# EAGLE design Qwiic_Quad_Relay (EAGLE 9.1.0)
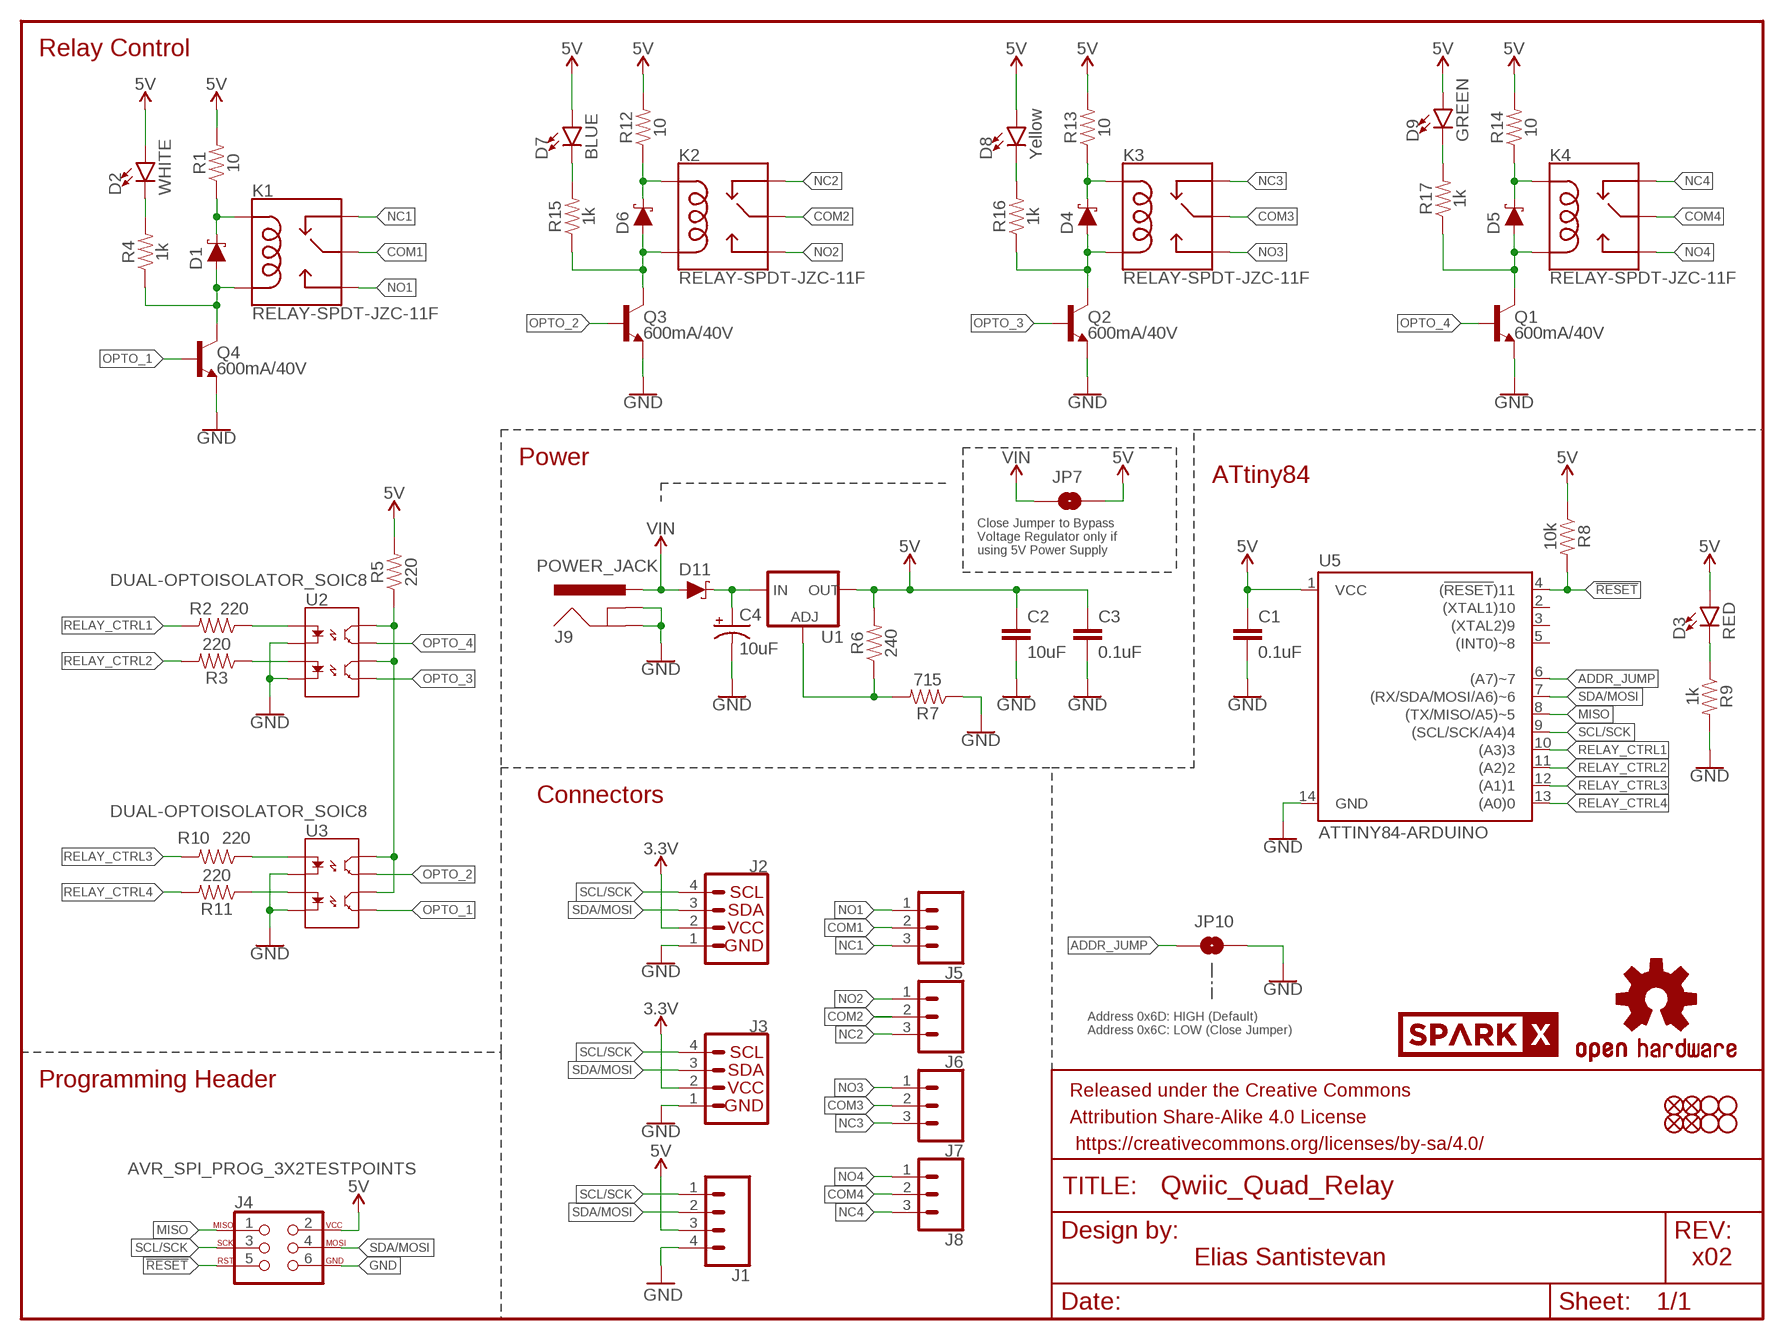
[diagram p0: schematic, sheet 1]

## Parts
C1  0.1uF  0.1UF-0603-25V-(+80/-20%)  [0603]
C2  10uF  10UF-0603-6.3V-20%  [0603]
C3  0.1uF  0.1UF-0603-25V-(+80/-20%)  [0603]
C4  10uF  10UF-POLAR-EIA3528-20V-10%(TANT)  [EIA3528]
D1  1A/23V/620mV  DIODE-SCHOTTKY-BAT20J  [SOD-323]
D2  WHITE  LED-WHITE0603  [LED-0603]
D3  RED  LED-RED0603  [LED-0603]
D4  1A/23V/620mV  DIODE-SCHOTTKY-BAT20J  [SOD-323]
D5  1A/23V/620mV  DIODE-SCHOTTKY-BAT20J  [SOD-323]
D6  1A/23V/620mV  DIODE-SCHOTTKY-BAT20J  [SOD-323]
D7  BLUE  LED-BLUE0603  [LED-0603]
D8  Yellow  LED-YELLOW0603  [LED-0603]
D9  GREEN  LED-GREEN0603  [LED-0603]
D11  1A/40V/500mV  DIODE-SCHOTTKY-SS14  [SMA-DIODE]
FRAME1  FRAME-LETTER  [CREATIVE_COMMONS]
J1  CONN_041X04_NO_SILK  [1X04_NO_SILK]
J2  Qwiic Right Angle  I2C_STANDARDQWIIC  [1X04_1MM_RA]
J3  Qwiic Right Angle  I2C_STANDARDQWIIC  [1X04_1MM_RA]
J4  AVR_SPI_PROG_3X2TESTPOINTS  [2X3_TEST_POINTS]
J5  CONN_03-SCREW-5MM  [SCREWTERMINAL-5MM-3]
J6  CONN_03-SCREW-5MM  [SCREWTERMINAL-5MM-3]
J7  CONN_03-SCREW-5MM  [SCREWTERMINAL-5MM-3]
J8  CONN_03-SCREW-5MM  [SCREWTERMINAL-5MM-3]
J9  POWER_JACK  [POWER_JACK_PTH]
JP1  STAND-OFF  [STAND-OFF]
JP2  FIDUCIAL1X2  [FIDUCIAL-1X2]
JP3  STAND-OFF  [STAND-OFF]
JP4  STAND-OFF  [STAND-OFF]
JP5  STAND-OFF  [STAND-OFF]
JP6  FIDUCIAL1X2  [FIDUCIAL-1X2]
JP7  JUMPER-SMT_2_NO_SILK  [SMT-JUMPER_2_NO_SILK]
JP8  FIDUCIAL1X2  [FIDUCIAL-1X2]
JP9  FIDUCIAL1X2  [FIDUCIAL-1X2]
JP10  JUMPER-SMT_2_NO_SILK  [SMT-JUMPER_2_NO_SILK]
K1  RELAY-SPDT-JZC-11F  [RELAY-JZC]
K2  RELAY-SPDT-JZC-11F  [RELAY-JZC]
K3  RELAY-SPDT-JZC-11F  [RELAY-JZC]
K4  RELAY-SPDT-JZC-11F  [RELAY-JZC]
LOGO1  OSHW-LOGOS  [OSHW-LOGO-S]
Q1  600mA/40V  TRANS_NPN-MMBT2222AL  [SOT23-3]
Q2  600mA/40V  TRANS_NPN-MMBT2222AL  [SOT23-3]
Q3  600mA/40V  TRANS_NPN-MMBT2222AL  [SOT23-3]
Q4  600mA/40V  TRANS_NPN-MMBT2222AL  [SOT23-3]
R1  10  10OHM-0603-1/10W-5%  [0603]
R2  220  220OHM-0603-1/10W-1%  [0603]
R3  220  220OHM-0603-1/10W-1%  [0603]
R4  1k  1KOHM-0603-1/10W-1%  [0603]
R5  220  220OHM-0603-1/10W-1%  [0603]
R6  240  240OHM-0603-1/10W-1%  [0603]
R7  715  715OHM-0603-1/10W-1%  [0603]
R8  10k  10KOHM-0603-1/10W-1%  [0603]
R9  1k  1KOHM-0603-1/10W-1%  [0603]
R10  220  220OHM-0603-1/10W-1%  [0603]
R11  220  220OHM-0603-1/10W-1%  [0603]
R12  10  10OHM-0603-1/10W-5%  [0603]
R13  10  10OHM-0603-1/10W-5%  [0603]
R14  10  10OHM-0603-1/10W-5%  [0603]
R15  1k  1KOHM-0603-1/10W-1%  [0603]
R16  1k  1KOHM-0603-1/10W-1%  [0603]
R17  1k  1KOHM-0603-1/10W-1%  [0603]
U1  V_REG_LM1117SOT223  [SOT223]
U2  DUAL-OPTOISOLATOR_SOIC8  [SO08]
U3  DUAL-OPTOISOLATOR_SOIC8  [SO08]
U5  ATTINY84-ARDUINO  [SO14]
U$12  SPARKX-LOGO4  [SPARKX-MEDIUM]

## Nets
3.3V: J2.2 J3.2
5V: C1.1 C2.1 C3.1 D2.A D3.A D7.A D8.A D9.A J1.3 J4.2 JP7.2 R1.2 R5.2 R6.2 R8.1 R12.2 R13.2 R14.2 U1.2(OUT) U1.4(OUT) U5.1(VCC)
!RESET: J4.5 R8.2 U5.4((!RESET!)11)
ADDR_JUMP: JP10.1 U5.6((A7)~7)
COM1: J5.2 K1.4(MAIN)
COM2: J6.2 K2.4(MAIN)
COM3: J7.2 K3.4(MAIN)
COM4: J8.2 K4.4(MAIN)
GND: C1.2 C2.2 C3.2 C4.C(-) J1.4 J2.1 J3.1 J4.6 J9.GND J9.GNDBREAK JP10.2 Q1.2(E) Q2.2(E) Q3.2(E) Q4.2(E) R7.1 R9.2 U2.2(C1) U2.4(C2) U3.2(C1) U3.4(C2) U5.14(GND)
MISO: J4.1 U5.8((TX/MISO/A5)~5)
N$1: D6.C K2.5(COIL1) R12.1
N$2: D1.A K1.1(COIL2) Q4.3(C) R4.1
N$3: R11.1 U3.3(A2)
N$4: C4.A(+) D11.C U1.3(IN)
N$5: R10.1 U3.1(A1)
N$6: R5.1 U2.6(CL2) U2.8(CL1) U3.6(CL2) U3.8(CL1)
N$7: D1.C K1.5(COIL1) R1.1
N$8: D2.C R4.2
N$9: R2.1 U2.1(A1)
N$11: R3.1 U2.3(A2)
N$12: D6.A K2.1(COIL2) Q3.3(C) R15.1
N$13: D3.C R9.1
N$14: D4.C K3.5(COIL1) R13.1
N$15: D4.A K3.1(COIL2) Q2.3(C) R16.1
N$16: D5.C K4.5(COIL1) R14.1
N$17: D5.A K4.1(COIL2) Q1.3(C) R17.1
N$19: R6.1 R7.2 U1.1(ADJ)
N$20: D9.C R17.2
N$21: D8.C R16.2
N$22: D7.C R15.2
NC1: J5.3 K1.2(NC)
NC2: J6.3 K2.2(NC)
NC3: J7.3 K3.2(NC)
NC4: J8.3 K4.2(NC)
NO1: J5.1 K1.3(NO)
NO2: J6.1 K2.3(NO)
NO3: J7.1 K3.3(NO)
NO4: J8.1 K4.3(NO)
OPTO_1: Q4.1(B) U3.5(EM2)
OPTO_2: Q3.1(B) U3.7(EM1)
OPTO_3: Q2.1(B) U2.5(EM2)
OPTO_4: Q1.1(B) U2.7(EM1)
RELAY_CTRL1: R2.2 U5.10((A3)3)
RELAY_CTRL2: R3.2 U5.11((A2)2)
RELAY_CTRL3: R10.2 U5.12((A1)1)
RELAY_CTRL4: R11.2 U5.13((A0)0)
SCL/SCK: J1.1 J2.4 J3.4 J4.3 U5.9((SCL/SCK/A4)4)
SDA/MOSI: J1.2 J2.3 J3.3 J4.4 U5.7((RX/SDA/MOSI/A6)~6)
VIN: D11.A J9.PWR JP7.1
Unconnected: U5.2((XTAL1)10) U5.3((XTAL2)9) U5.5((INT0)~8)

## Notes on the sheet
- Relay Control
- Power
- ATtiny84
- Close Jumper to Bypass
  Voltage Regulator only if 
  using 5V Power Supply
- Connectors
- Address 0x6D: HIGH (Default)
  Address 0x6C: LOW (Close Jumper)
- Programming Header
- Elias Santistevan | x02

## Library data of the parts
C1 C3 = SparkFun-Capacitors:0.1UF: 0.1µF ceramic capacitors A capacitor is a passive two-terminal electrical component used to store electrical energy temporarily in an electric field.; PROD_ID: CAP-00810
C2 = SparkFun-Capacitors:10UF: 10.0µF ceramic capacitors A capacitor is a passive two-terminal electrical component used to store electrical energy temporarily in an electric field.; PROD_ID: CAP-11015
C4 = SparkFun-Capacitors:10UF-POLAR: 10.0µF polarized capacitors A capacitor is a passive two-terminal electrical component used to store electrical energy temporarily in an electric field.; PROD_ID: CAP-08063
D1 D4-D6 = SparkFun-DiscreteSemi:DIODE-SCHOTTKY: Schottky diode A Schottky diode is a semiconductor diode which has a low forward voltage drop and a very fast switching action.; PROD_ID: DIO-11623
D2 = SparkFun-LED:LED-WHITE: White SMD LED Used in manufacturing several products at SparkFun. Packages: 0603 - Bright White SMD 0603 package[Product Link] <http://www.kingbrightusa.com/product.asp?catalog_name=LED&product_id=APT1608QWF/D> 1206 - Bright White SMD1206 package [Product Link] <http://www.kingbrightusa.com/product.asp?catalog_name=LED&product_id=APT3216QWF/D> 3014 - Super Bright SMD 3014 package [Datasheet] <http://www.lumileds.com/uploads/459/DS208-pdf> SparkFun Products: Blackberry Trackballer Breakout <https://www.sparkfun.com/products/13169> Digital SandBox <https://www.sparkfun.com/products/12651>; PROD_ID: DIO-09004
D3 = SparkFun-LED:LED-RED: Red SMD LED Used in manufacturing of most products at SparkFun Packages: 0603 - SMD 0603 package [Product Link] <http://docs.avagotech.com/docs/AV02-0551EN> 0603 SMART - SMD 0603 SMART package ( more efficient and expensive)[Product Link] <http://www.osram-os.com/Graphics/XPic2/00077099_0.pdf> 1206 - SMD1206 package [Product Link] <https://www.sparkfun.com/datasheets/DevTools/LilyPad/Q150OVS4.pdff> SparkFun Products: Pro Mini 328 -5V <https://www.sparkfun.com/products/821> RedBoard <https://www.sparkfun.com/products/12757> IOIO-OTG <https://www.sparkfun.com/products/13613>; PROD_ID: DIO-00819
D7 = SparkFun-LED:LED-BLUE: Blue SMD LED Used in manufacturing of various products at SparkFun Packages: 0603 - SMD 0603 package [Product Link] <http://www.digikey.com/product-detail/en/SMLE12BC7TT86/511-1589-2-ND/1641808> 1206 - SMD1206 package [Product Link] <http://www.digikey.com/product-detail/en/lite-on-inc/LTST-C150TBKT/160-1643-1-ND/573584> SparkFun Products: ESP8266 Thing-Dev Board <https://www.sparkfun.com/products/13711> RedBoard <https://www.sparkfun.com/products/12757>; PROD_ID: DIO-08575
D8 = SparkFun-LED:LED-YELLOW: Yellow SMD LED Used in manufacturing several products at SparkFun. Packages: 0603 - SMD 0603 package[Product Link] <http://www.kingbrightusa.com/product.asp?catalog_name=LED&product_id=APT1608SYCK> 0603 -SMART - SMART SMD 0603 package (more efficient/more expensive) [Product Link] <http://www.osram-os.com/osram_os/en/products/product-catalog/led-light-emitting-diodes/smartled-0603/ly-l29k/index.jsp> LilyPad - SMD1206 package[Product Datasheet] <https://www.sparkfun.com/datasheets/DevTools/LilyPad/Q150YUS4.pdf> SparkFun Products: Blynk Board <https://www.sparkfun.com/products/13794> IOIO-OTG <https://www.sparkfun.com/products/13613> XBee Explorer Serial <https://www.sparkfun.com/products/13225>; PROD_ID: DIO-09003
D9 = SparkFun-LED:LED-GREEN: Green SMD LED Used in manufacturing of various products at SparkFun Packages: 0603 - SMD 0603 package [Product Link] <http://www.futureelectronics.com/en/technologies/semiconductors/optoelectronics/leds/Pages/9894312-LTST-C190GKT.aspx?CrossPart=HSMG-C190&IM=0> LilyPad 1206 - SMD1206 LilyPad package [Product Link] <http://www.futureelectronics.com/en/Technologies/Product.aspx?ProductID=IN150NGHARVATEKCORPORATION2049943&IM=0> 1206 - SMD1206 package [Product Link] <http://www.futureelectronics.com/en/technologies/semiconductors/optoelectronics/leds/Pages/8315665-LTST-C150KGKT.aspx?IM=0> 1206 Bottom Mount -SMD 1206 Bottom Mount [Product Link] <http://www.digikey.com/product-detail/en/lite-on-inc/LTST-C230KGKT/160-1456-1-ND/386854> SparkFun Products: Pro Mini 328 -5V <https://www.sparkfun.com/products/821> RedBoard <https://www.sparkfun.com/products/12757> MP3 Trigger <https://www.sparkfun.com/products/13720> Makey Makey <https://www.sparkfun.com/products/11076>; PROD_ID: DIO-00821
D11 = SparkFun-DiscreteSemi:DIODE-SCHOTTKY: Schottky diode A Schottky diode is a semiconductor diode which has a low forward voltage drop and a very fast switching action.; PROD_ID: DIO-08053
FRAME1 = SparkFun-Aesthetics:FRAME-LETTER: Schematic Frame - Letter Standard 8.5x11 US Letter frame
J1 = SparkFun-Connectors:CONN_04: Multi connection point. Often used as Generic Header-pin footprint for 0.1 inch spaced/style header connections On any of the 0.1 inch spaced packages, you can populate with these: Break Away Headers - Straight <https://www.sparkfun.com/products/116> (PRT-00116) Break Away Male Headers - Right Angle <https://www.sparkfun.com/products/553> (PRT-00553) Female Headers <https://www.sparkfun.com/products/115> (PRT-00115) Break Away Headers - Machine Pin <https://www.sparkfun.com/products/117> (PRT-00117) Break Away Female Headers - Swiss Machine Pin <https://www.sparkfun.com/products/743> (PRT-00743) For SCREWTERMINALS and SPRING TERMINALS visit here: Screw Terimnals on SparkFun.com <https://www.sparkfun.com/search/results?term=Screw+Terminals> (5mm/3.5mm/2.54mm spacing) This device is also useful as a general connection point to wire up your design to another part of your project. Our various solder wires solder well into these plated through hole pads. Hook-Up Wire - Assortment (Stranded, 22 AWG) <https://www.sparkfun.com/products/11375> (PRT-11375) Hook-Up Wire - Assortment (Solid Core, 22 AWG) <https://www.sparkfun.com/products/11367> (PRT-11367) View the entire wire category on our website here <https://www.sparkfun.com/categories/141> Special notes: Molex polarized connector foot print use with SKU : PRT-08231 with associated crimp pins and housings. 1MM SMD Version SKU: PRT-10208; PROD_ID: CONN-09696
J2 J3 = SparkFun-Connectors:I2C_STANDARD: SparkFun I2C Standard Pinout Header SparkFun has standardized on a pinout for all I2C based sensor breakouts. This pinout allows I2C boards to be plugged directly into the headers on Arduino Uno compatible boards, and to be daisy chained easily. Example SparkFun Products: SparkFun Atmospheric Sensor Breakout - BME280 <https://www.sparkfun.com/products/13676> SparkFun Altitude/Pressure Sensor Breakout - MPL3115A2 <https://www.sparkfun.com/products/11084> SparkFun TOF Range Finder Sensor - VL6180 <https://www.sparkfun.com/products/12785>; PROD_ID: CONN-13694
J4 = SparkFun-Connectors:AVR_SPI_PROG_3X2: AVR ISP 6 Pin This is the reduced ISP connector for AVR programming. Common on Arduino. This footprint will take up less PCB space and can be used with a 10-pin to 6-pin adapter such as SKU: BOB-08508 **Special note about "TEST_POINT" package. The stop mask is on the top side, so if you want your programming test points to be on the bottom of your board, make sure to place this package on the bottom side of the board. This also ensure that the orientation to program from the bottom side will be correct. SparkFun Products: SparkFun ISP Pogo Adapter <https://www.sparkfun.com/products/11591> - NS Tiny AVR Programmer <https://www.sparkfun.com/products/11801> -PTH
J5-J8 = SparkFun-Connectors:CONN_03: Multi connection point. Often used as Generic Header-pin footprint for 0.1 inch spaced/style header connections On any of the 0.1 inch spaced packages, you can populate with these: Break Away Headers - Straight <https://www.sparkfun.com/products/116> (PRT-00116) Break Away Male Headers - Right Angle <https://www.sparkfun.com/products/553> (PRT-00553) Female Headers <https://www.sparkfun.com/products/115> (PRT-00115) Break Away Headers - Machine Pin <https://www.sparkfun.com/products/117> (PRT-00117) Break Away Female Headers - Swiss Machine Pin <https://www.sparkfun.com/products/743> (PRT-00743) Stackable Header - 3 Pin (Female, 0.1") <https://www.sparkfun.com/products/13875> (PRT-13875) For SCREWTERMINALS and SPRING TERMINALS visit here: Screw Terimnals on SparkFun.com <https://www.sparkfun.com/search/results?term=Screw+Terminals> (5mm/3.5mm/2.54mm spacing) This device is also useful as a general connection point to wire up your design to another part of your project. Our various solder wires solder well into these plated through hole pads. Hook-Up Wire - Assortment (Stranded, 22 AWG) <https://www.sparkfun.com/products/11375> (PRT-11375) Hook-Up Wire - Assortment (Solid Core, 22 AWG) <https://www.sparkfun.com/products/11367> (PRT-11367) View the entire wire category on our website here <https://www.sparkfun.com/categories/141> Special notes: Molex polarized connector foot print use with SKU : PRT-08232 with associated crimp pins and housings.; PROD_ID: CONN-10134; SF_SKU: PRT-08433
J9 = SparkFun-Connectors:POWER_JACK: Power Jack Connector This is the standard 5.5mm barrel jack for power. The PTH is the most common, proven, reliable, footprint. The Slot footprint only works if the mill layer is transmitted to the PCB fab house so be warned. Here are the connectors we sell at SparkFun: DC Barrel Power Jack/Connector <https://www.sparkfun.com/products/119> (PRT-00119) DC Barrel Power Jack/Connector (SMD) <https://www.sparkfun.com/products/12748> (PRT-12748) DC Barrel Jack Adapter - Breadboard Compatible <https://www.sparkfun.com/products/10811> (PRT-10811) It is used on this SparkFun product (and many, many others): SparkFun RedBoard - Programmed with Arduino <https://www.sparkfun.com/products/12757> (DEV-12757) Also, if you need a mating power supply or connector, please check these out: Wall Adapter Power Supply - 9VDC 650mA <https://www.sparkfun.com/products/298> (TOL-00298) DC Barrel Jack Adapter - Male <https://www.sparkfun.com/products/10287> (PRT-10287); PROD_ID: CONN-08197
JP1 JP3-JP5 = SparkFun:STAND-OFF: Stand Off This is the mechanical footprint for a #4 phillips button head screw. Use the keepout ring to avoid running the screw head into surrounding components. SKU : PRT-00447
JP2 JP6 JP8 JP9 = SparkFun-Aesthetics:FIDUCIAL: Fiducial Alignment Points Point-of-reference for pick-and-place machines and other optical instruments.
JP7 JP10 = SparkFun-Jumpers:JUMPER-SMT_2_NO: Normally open jumper This jumper has two pads in close proximity to each other. Apply solder to close the connection. Round pads are easier to solder for beginners, but are a lot larger. SparkFun Product that uses the round pads: SparkFun EL Sequencer <https://www.sparkfun.com/products/12781>
K1-K4 = SparkFun-Electromechanical:RELAY-SPDT: SPDT Electromechanical Relay Single-pole, double-throw sealed relays. When current is applied to the coil, it throws a simple changeover switch, terminating the connection from the NC contact to ground and closing the NO contact. Use them to switch high voltage/high current devices. SparkFun Products JQX-15F: Relay SPDT Sealed - 20A <https://www.sparkfun.com/products/10924> (COM-10924) JZC-11F: Relay SPDT Sealed <https://www.sparkfun.com/products/100> (COM-00100); PROD_ID: COMP-09533; SF_SKU: COM-00100
LOGO1 = SparkFun-Aesthetics:OSHW-LOGO: Open-Source Hardware (OSHW) Logo This logo indicates the piece of hardware it is found on incorporates a OSHW license and/or adheres to the definition of open source hardware found here: http://freedomdefined.org/OSHW
Q1-Q4 = SparkFun-DiscreteSemi:TRANS_NPN: NPN transistor Current controlled devices typically used to amplify current or used as a switch. BC547 - COM-08928 <http://www.sparkfun.com/products/8928> (TO-92 45V 100mA) (1.Collector 2.Base 3.Emitter) 2N3904 - COM-00521 <http://www.sparkfun.com/products/521> (TO-92 40V 200mA) (1.Emitter 2.Base 3.Collector) P2N2222A - COM-12852 <http://www.sparkfun.com/products/12852> (TO-92 40V 600mA) (1.Collector 2.Base 3.Emitter); PROD_ID: TRANS-08049
R1 R12-R14 = SparkFun-Resistors:10OHM: 10Ω resistor A resistor is a passive two-terminal electrical component that implements electrical resistance as a circuit element. Resistors act to reduce current flow, and, at the same time, act to lower voltage levels within circuits. - Wikipedia; PROD_ID: RES-09834
R2 R3 R5 R10 R11 = SparkFun-Resistors:220OHM: 220Ω resistor A resistor is a passive two-terminal electrical component that implements electrical resistance as a circuit element. Resistors act to reduce current flow, and, at the same time, act to lower voltage levels within circuits. - Wikipedia; PROD_ID: RES-07861
R4 R9 R15-R17 = SparkFun-Resistors:1KOHM: 1kΩ resistor A resistor is a passive two-terminal electrical component that implements electrical resistance as a circuit element. Resistors act to reduce current flow, and, at the same time, act to lower voltage levels within circuits. - Wikipedia; PROD_ID: RES-07856
R6 = SparkFun-Resistors:240OHM: 240Ω resistor A resistor is a passive two-terminal electrical component that implements electrical resistance as a circuit element. Resistors act to reduce current flow, and, at the same time, act to lower voltage levels within circuits. - Wikipedia; PROD_ID: RES-07849
R7 = SparkFun-Resistors:715OHM: 715Ω resistor A resistor is a passive two-terminal electrical component that implements electrical resistance as a circuit element. Resistors act to reduce current flow, and, at the same time, act to lower voltage levels within circuits. - Wikipedia; PROD_ID: RES-07850
R8 = SparkFun-Resistors:10KOHM: 10kΩ resistor A resistor is a passive two-terminal electrical component that implements electrical resistance as a circuit element. Resistors act to reduce current flow, and, at the same time, act to lower voltage levels within circuits. - Wikipedia; PROD_ID: RES-00824
U1 = SparkFun-IC-Power:V_REG_LM1117: Voltage Regulator LM1117 Standard adjustable voltage regulator but in SMD form. Spark Fun Electronics SKU : COM-00595; PROD_ID: VREG-08170
U2 U3 = SparkFun-DiscreteSemi:DUAL-OPTOISOLATOR: Optocoupler, Phototransistor Output, Dual Channel Optically coupled pairs with a gallium arsenide infrared LED and a silicon NPN phototransistor. Signal information, including a DC level, can be transmitted by the device while maintaining a high degree of electrical isolation between input and output. Datasheet <https://www.sparkfun.com/datasheets/Components/SMD/ild205t.pdf> SparkFun Products: SparkFun Opto-isolator Breakout <https://www.sparkfun.com/products/9118>; PROD_ID: IC-09076
U5 = SparkFun-IC-Microcontroller:ATTINY84-ARDUINO; PROD_ID: IC-11285
U$12 = SparkX:SPARKX-LOGO

## Board
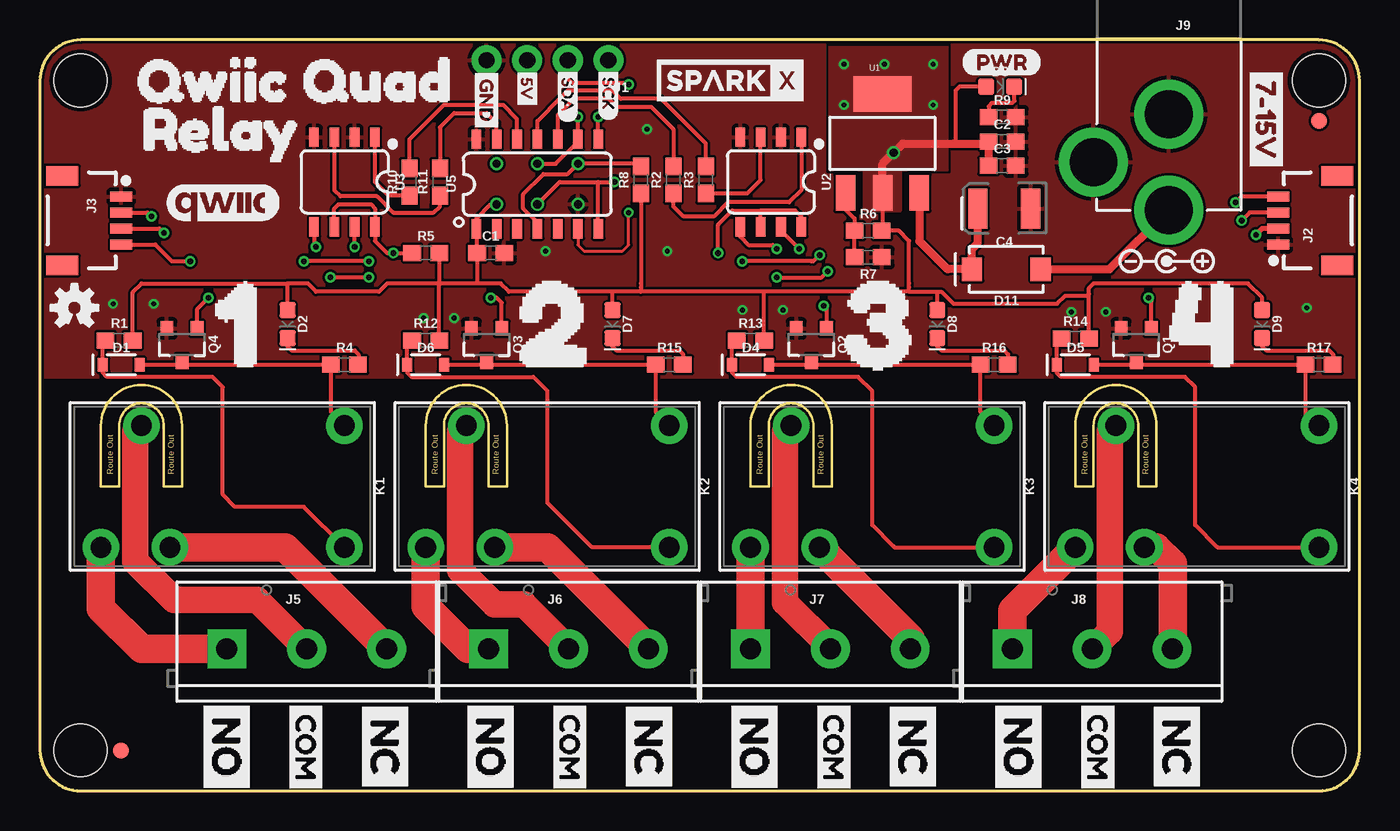
[diagram p1: board, top side]
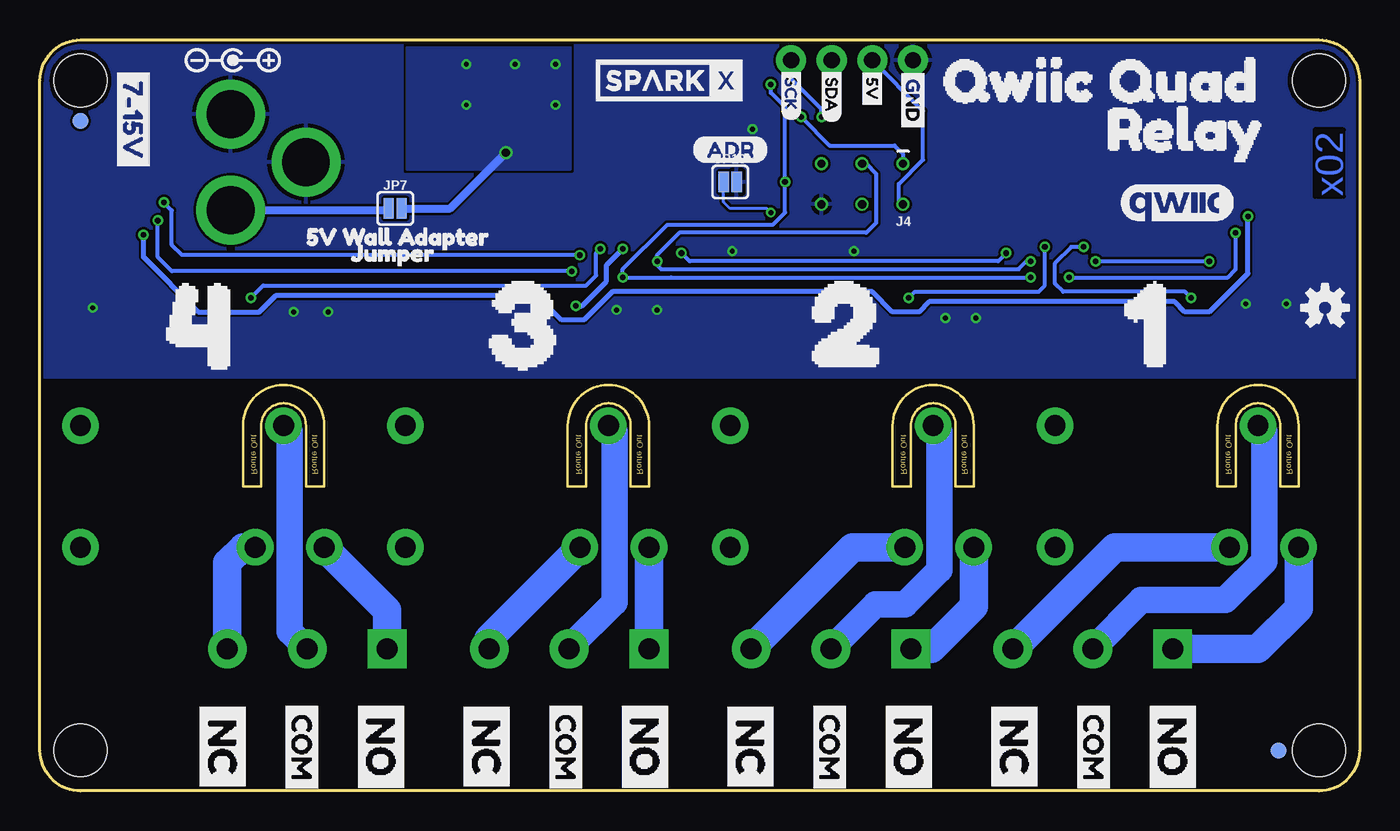
[diagram p2: board, bottom side, seen from below]

Size 82.55 x 46.99 mm. Coordinates in mm from the lower left corner, seen from the top.
Outline: 80.01,46.99 2.54,46.99 arc90 0,44.45 0,2.54 arc90 2.54,0 80.01,0 arc90 82.55,2.54 82.55,44.45 arc90 80.01,46.99
Copper layers (1*16): Top 0.035mm / dielectric 1.5mm / Bottom 0.035mm
Design rules "SparkFun-2-layer-PCBWay-LIMIT": minimum track width 6mil, minimum drill 0.3mm, track to track 6mil, track to pad 6mil, pad to pad 6mil, via to via 6mil, smd to smd 6mil, copper to edge 6mil, drill to drill 6mil, minimum pad ring 6mil, minimum via ring 6mil, stop-mask expansion 4mil, vias tented up to drill 25mil, thermal gap 10mil
Milling: 40 lines

### Footprints (pad centres in the part's own frame; a part is rotated, then mirrored left to right if it is on the bottom)
0603 = smd 1.1 x 1: 1 -0.85,0; 2 0.85,0
EIA3528 = smd 1.2 x 2.5: A 1.65,0; C -1.65,0
SOD-323 = smd 0.63 x 0.83: A 1.15,0; C -1.15,0
LED-0603 = smd 1 x 1: A -0.877,0; C 0.877,0
SMA-DIODE = smd 1.27 x 1.47: A -2.15,0; C 2.15,0
1X04_NO_SILK = drill 1.016 pad 1.88: 1 0,0; 2 2.54,0; 3 5.08,0; 4 7.62,0
1X04_1MM_RA = smd 0.6 x 1.35: 1 -1.5,0; 2 -0.5,0; 3 0.5,0; 4 1.5,0 | smd 1.2 x 2: NC1 2.8,-3.675; NC2 -2.8,-3.675
2X3_TEST_POINTS = drill 0.508: 1 -2.54,-1.27; 2 -2.54,1.27; 3 0,-1.27; 4 0,1.27; 5 2.54,-1.27; 6 2.54,1.27
SCREWTERMINAL-5MM-3 = drill 1.3 pad 2.413 square: 1 0,0 | drill 1.3 pad 2.413: 2 5,0; 3 10,0
POWER_JACK_PTH = drill 2.997 pad 4.318: GND 0,7.7; GNDBREAK 4.7,10.7; PWR 0,13.7
STAND-OFF = hole 3.302: 0,0
FIDUCIAL-1X2 = smd 1 x 1: 1 0,0
SMT-JUMPER_2_NO_SILK = smd 0.635 x 1.27: 1 -0.406,0; 2 0.406,0
RELAY-JZC = drill 1.3 pad 2.286: 1 3.81,-8.89; 2 -3.81,2.032; 3 -3.81,6.35; 4 3.81,3.81; 5 -3.81,-8.89
SOT23-3 = smd 0.8 x 0.9: 1 -0.95,-1; 2 0.95,-1; 3 0,1.1
SOT223 = smd 1.219 x 2.235: 1 -2.311,-3.099; 2 0,-3.099; 3 2.311,-3.099 | smd 3.6 x 2.2: 4 0,3.099
SO08 = smd 0.6 x 1.2: 1 -1.905,-2.8; 2 -0.635,-2.8; 3 0.635,-2.8; 4 1.905,-2.8; 5 1.905,2.8; 6 0.635,2.8; 7 -0.635,2.8; 8 -1.905,2.8
SO14 = smd 0.6 x 1.2: 1 -3.175,-2.8; 2 -1.905,-2.8; 3 -0.635,-2.8; 4 0.635,-2.8; 5 1.905,-2.8; 6 3.175,-2.8; 7 4.445,-2.8; 8 4.445,2.8; 9 3.175,2.8; 10 1.905,2.8; 11 0.635,2.8; 12 -0.635,2.8; 13 -1.905,2.8; 14 -3.175,2.8

### Placement (x,y rotation side)
C1  28.19,33.66 0 top
C2  60.2,40.64 0 top
C3  60.2,39.12 0 top
C4  60.33,36.45 180 top
D1  5.08,26.67 0 top
D2  15.49,29.21 270 top
D3  60.07,44.07 0 top
D4  44.45,26.67 0 top
D5  64.77,26.67 0 top
D6  24.13,26.67 0 top
D7  35.81,29.21 270 top
D8  56.13,29.21 270 top
D9  76.45,29.21 270 top
D11  60.45,32.64 180 top
FRAME1  10.16,-16.51 0 top  (outside the outline)
J1  35.56,45.72 180 top
J2  77.47,35.69 90 top
J3  5.08,35.69 270 top
J4  31.11,37.97 180 bottom
J5  11.68,8.89 0 top
J6  28.07,8.89 0 top
J7  44.45,8.89 0 top
J8  60.83,8.89 0 top
J9  70.61,50.04 180 top
JP1  2.54,2.54 0 top
JP2  80.01,41.91 0 bottom
JP3  2.54,44.45 0 top
JP4  80.01,44.45 0 top
JP5  80.01,2.54 0 top
JP6  5.08,2.54 0 bottom
JP7  60.33,36.45 0 bottom
JP8  5.08,2.54 0 top
JP9  80.01,41.91 0 top
JP10  39.37,38.1 0 bottom
K1  10.16,19.05 90 top
K2  30.48,19.05 90 top
K3  50.8,19.05 90 top
K4  71.12,19.05 90 top
LOGO1  2.16,30.23 0 top
Q1  68.58,27.94 180 top
Q2  48.26,27.94 180 top
Q3  27.94,27.94 180 top
Q4  8.89,27.94 180 top
R1  4.95,28.19 0 top
R2  39.62,38.23 90 top
R3  41.66,38.23 90 top
R4  19.05,26.67 0 top
R5  24.13,33.66 0 top
R6  51.82,35.05 0 top
R7  51.82,33.4 180 top
R8  37.59,38.23 90 top
R9  60.2,42.16 0 top
R10  23.11,38.1 90 top
R11  25.02,38.1 90 top
R12  24.13,28.19 0 top
R13  44.45,28.19 0 top
R14  64.77,28.32 0 top
R15  39.37,26.67 0 top
R16  59.69,26.67 0 top
R17  80.01,26.67 0 top
U1  52.7,40.51 0 top
U2  45.72,38.1 180 top
U3  19.05,38.1 180 top
U5  30.48,37.97 0 top
U$1  [PWR-()-04]  57.66,45.59 0 top
U$2  [20]  25.4,29.21 0 top
U$3  [10]  6.35,29.21 0 top
U$4  [30]  45.72,29.21 0 top
U$5  [40]  66.04,29.21 0 top
U$6  [QWIIC_QUAD_0]  3.81,44.45 0 top
U$7  [RELAY0]  4.19,41.4 0 top
U$8  [SCK-[)-03]  35.56,45.34 270 top
U$9  [GND-03]  27.94,45.34 270 top
U$10  [5V0]  30.48,45.34 270 top
U$11  [SDA0]  33.02,45.34 270 top
U$12  43.18,44.45 0 top
U$13  [OSHW-LOGO-S]  2.16,30.23 0 bottom
U$14  [SPARKX-MEDIUM]  43.18,44.45 0 bottom
U$15  [NO0]  11.68,6.22 270 top
U$16  [COM0]  16.64,5.97 270 top
U$17  [NC0]  21.59,6.1 270 top
U$18  [NO0]  28.19,6.22 270 top
U$19  [COM0]  33.15,5.97 270 top
U$20  [NC0]  38.1,6.1 270 top
U$21  [NO0]  44.7,6.22 270 top
U$22  [COM0]  49.66,5.97 270 top
U$23  [NC0]  54.61,6.1 270 top
U$24  [NO0]  61.21,6.22 270 top
U$25  [COM0]  66.17,5.97 270 top
U$26  [NC0]  71.12,6.1 270 top
U$27  [NO0]  44.7,6.22 270 bottom
U$28  [COM0]  66.17,5.97 270 bottom
U$29  [NC0]  71.12,6.1 270 bottom
U$30  [NO0]  61.21,6.22 270 bottom
U$31  [COM0]  49.66,5.97 270 bottom
U$32  [NC0]  54.61,6.1 270 bottom
U$33  [NO0]  28.19,6.22 270 bottom
U$34  [COM0]  33.15,5.97 270 bottom
U$35  [NC0]  38.1,6.1 270 bottom
U$36  [NO0]  11.68,6.22 270 bottom
U$37  [COM0]  16.64,5.97 270 bottom
U$38  [NC0]  21.59,6.1 270 bottom
U$39  [10]  19.3,29.21 0 bottom
U$40  [20]  38.86,29.21 0 bottom
U$41  [30]  59.05,29.21 0 bottom
U$42  [40]  79.25,29.08 0 bottom
U$43  [QWIIC_QUAD_0]  28.32,44.45 0 bottom
U$44  [RELAY0]  18.03,41.4 0 bottom
U$45  [GND-03]  27.94,45.34 270 bottom
U$46  [5V0]  30.48,45.34 270 bottom
U$47  [SDA0]  33.02,45.34 270 bottom
U$48  [SCK-[)-03]  35.56,45.34 270 bottom
U$49  [7#15V0]  76.71,45.59 270 top
U$50  [5V_WALL_ADAPTER0]  66.8,34.67 0 bottom
U$51  [POLARITY_MARKING_CENTER_POSITIVE#JPG]  70.48,33.15 0 top
U$52  [JUMPER0]  64.01,33.66 0 bottom
U$53  [7#15V0]  76.71,45.59 270 bottom
U$54  [POLARITY_MARKING_CENTER_POSITIVE#JPG]  70.48,45.72 0 bottom
U$55  [QWIIC#JPG]  11.43,36.83 0 top
U$56  [ADR-()-04]  41.78,40.13 0 bottom
U$57  [QWIIC#JPG]  11.43,36.83 0 bottom

### Tracks (layer width: path | path; a pad name or v marks a point on that pad's centre or on a via)
3.3V  (via drill 0.35)
  Top 0.254: J3.2 6.74,36.19 v6.99,35.94
  Top 0.305: J2.2 76.46,35.19 v76.07,34.8
  Bottom 0.305: v6.99,35.94 6.99,32.38 9.4,29.97 10.92,29.97 11.56,30.61 26.92,30.61 27.56,29.97 29.21,29.97 30.48,31.24 46.74,31.24 48.51,29.46 49.91,29.46 51.44,30.99 67.82,30.99 68.83,29.97 72.64,29.97 76.07,33.4 v76.07,34.8
5V  (via drill 0.3, 0.51)
  Top 0.254: 54.37,31.24 45.3,31.24 | 45.3,31.24 37.59,31.24 | R8.1 37.59,31.75 37.59,31.5 37.59,31.24 | 15.49,31.75 6.35,31.75 5.8,31.2 R1.2 | D9.A 76.45,30.86 75.56,31.75 65.91,31.75 65.66,31.5 65.62,31.46 65.62,31.11 | D2.A 15.49,31.75 | J4.2 28.19,36.7 27.3,35.81 U5.1 27.34,35.13 C1.1 27.34,31.79 27.3,31.75 | D3.A 57.53,44.07 57.28,43.81 57.28,40.64 57.15,40.51 | U1.2 52.7,35.09 | 52.7,35.09 R6.2 | 52.7,35.09 52.74,35.05 53.72,35.05 54.37,34.41 54.37,31.75 54.37,31.5 54.37,31.24 | R14.2 65.62,31.11 | R13.2 45.3,31.24 | 37.59,31.24 35.81,31.24 | 35.81,31.24 29.34,31.24 28.83,31.75 27.3,31.75 | 27.3,31.75 25.02,31.75 | 25.02,31.75 24.89,31.75 | 24.89,31.75 21.72,31.75 21.21,31.24 17.27,31.24 16.76,31.75 15.49,31.75 | R12.2 24.98,31.66 24.89,31.75 | 25.02,31.75 24.98,31.79 R5.2 | D7.A 35.81,31.24 | 54.37,31.24 56.13,31.24 | 56.13,31.24 56.39,31.24 57.15,30.48 63.63,30.48 64.14,30.99 65.49,30.99 65.62,31.11 | D8.A 56.13,31.24
  Top 0.508: C3.1 C2.1 59.22,40.51 57.15,40.51 53.98,40.51 v53.4,39.94 52.7,39.24 U1.2
  Bottom 0.254: J1.3 27.3,42.55 27.3,39.5 28.83,37.97 28.83,36.96 J4.2
  Bottom 0.508: JP7.2 56.9,36.45 v53.4,39.94
  other vias: 50.29,45.47 52.83,45.47 55.88,45.47 55.88,42.93 50.29,42.93
  pour Top (isolate 0.305, no thermals): 49.4,46.61 49.4,38.86 51.56,38.86 51.56,36.32 53.85,36.32 53.85,38.86 56.77,38.86 56.77,46.61
  pour Bottom (isolate 0.305, no thermals): 49.4,46.61 49.4,38.86 59.56,38.86 59.56,46.61
!RESET
  Top 0.254: U5.4 31.11,35.55 30.23,36.44 30.23,37.34 31.5,38.61 33.02,38.61 J4.5 37.43,39.24 R8.2
ADDR_JUMP  (via drill 0.3)
  Top 0.203: U5.6 33.66,34.16 34.04,33.78 36.45,33.78 36.83,34.16 v36.83,36.2
  Bottom 0.203: v36.83,36.2 37.08,36.45 39.37,36.45 39.78,36.85 JP10.1
COM1
  Top 1.651: J5.2 16.64,8.89 13.59,11.94 8.89,11.94 8.38,11.94 5.97,14.35 5.97,22.48 K1.4
  Bottom 1.651: J5.2 13.64,11.94 8.38,11.94 5.97,14.35 5.97,22.48 K1.4
COM2
  Top 1.651: J6.2 30.27,11.68 28.45,11.68 26.29,13.84 26.29,22.48 K2.4
  Bottom 1.651: J6.2 30.27,11.68 28.45,11.68 26.29,13.84 26.29,22.48 K2.4
  Bottom 1.778: J6.2
COM3
  Top 1.651: 49.45,8.97 46.61,11.81 46.61,22.48 K3.4
  Top 1.778: 49.45,8.97 J7.2
  Bottom 1.651: 49.45,8.97 46.61,11.81 46.61,22.48 K3.4
  Bottom 1.778: 49.45,8.97 J7.2
COM4
  Top 1.651: K4.4 66.93,22.48 66.93,9.99 J8.2
  Bottom 1.651: K4.4 66.93,22.48 66.93,9.99 J8.2
GND  (via drill 0.3)
  other vias: 46.48,30.1 66.67,29.97 25.91,29.59 7.11,30.48 64.52,29.97 79.25,30.23 43.94,30.1 4.57,30.48 24,29.59 31.62,33.78 39.24,33.78 37.97,41.4
  pour Bottom (rank 2): 0,25.91 82.55,25.91 82.55,46.99 0,46.99
  pour Top (rank 2): 0,25.91 0,46.99 82.55,46.99 82.55,25.91
MISO  (via drill 0.35)
  Top 0.254: U5.8 v34.92,42.16
  Bottom 0.254: v34.92,42.16 33.15,40.39 29.08,40.39 28.57,39.88 J4.1
N$1
  Top 0.254: K2.5 34.54,15.24 31.75,18.03 31.75,25.02 30.99,25.78 30.86,25.91 23.24,25.91 22.98,26.17 D6.C 22.98,27.89 R12.1
N$2
  Top 0.254: D1.A 8.72,26.67 Q4.3 9.06,26.67 R4.1 18.2,23.71 K1.1
N$3
  Top 0.254: U3.3 18.41,37.59 18.8,37.21 21.08,37.21 22.1,36.2 24.64,36.2 25.02,36.58 R11.1
N$4
  Top 0.508: U1.3 55.02,34.39 56.13,33.27 56.77,32.64 D11.C 58.3,33.92 58.67,34.29 C4.A
N$5
  Top 0.254: R10.1 21.8,37.25 20.95,38.1 U3.1
N$6  (via drill 0.35)
  Top 0.254: U3.6 18.41,36.45 18.67,36.7 20.7,36.7 20.95,36.45 U3.8 20.95,34.42 21.72,33.66 v22.1,33.66 R5.1 | 45.09,36.32 46.99,36.32 47.24,36.32 47.62,35.94 U2.8 | U2.6 45.09,36.32 | v42.42,33.66 42.42,35.43 43.31,36.32 45.09,36.32
  Bottom 0.254: v42.42,33.66 41.91,33.15 22.61,33.15 v22.1,33.66
N$7
  Top 0.254: R1.1 3.93,28.02 D1.C 3.93,26.17 4.19,25.91 10.79,25.91 11.43,25.27 11.43,18.54 12.19,17.78 16.51,17.78 K1.5
N$8
  Top 0.254: R4.2 19.93,26.7 19.93,27.32 19.68,27.56 15.75,27.56 15.49,27.81 D2.C
N$9
  Top 0.254: U2.1 47.62,37.59 46.86,36.83 43.05,36.83 42.16,35.94 40.26,35.94 39.62,36.58 R2.1
N$11
  Top 0.254: U2.3 45.09,38.23 44.23,37.38 R3.1
N$12
  Top 0.254: K2.1 38.52,23.71 R15.1 28.11,26.67 Q3.3 27.77,26.67 D6.A
N$13
  Top 0.254: D3.C 60.96,44.06 60.96,43.18 60.83,43.05 59.56,43.05 59.35,42.84 R9.1
N$14
  Top 0.254: R13.1 43.3,27.89 D4.C 43.3,26.17 43.56,25.91 51.18,25.91 52.07,25.02 | 52.07,25.02 52.07,16.64 53.4,15.3 53.47,15.24 K3.5 | 52.07,25.02 arc90 52.07,25.02
N$15
  Top 0.254: D4.A 48.09,26.67 Q2.3 48.43,26.67 R16.1 58.84,23.71 K3.1
N$16
  Top 0.254: 72.26,16.64 73.66,15.24 K4.5 | R14.1 63.62,28.02 D5.C 63.63,26.16 63.88,25.91 71.63,25.91 72.26,25.27 72.26,16.64 | 72.26,16.64
N$17
  Top 0.254: D5.A 68.41,26.67 Q1.3 68.75,26.67 R17.1 79.16,22.86 K4.1
N$19
  Top 0.254: U1.1 50.39,36.39 50.97,35.81 R6.1 R7.2
N$20
  Top 0.254: R17.2 80.89,26.7 80.9,26.71 80.9,27.3 80.64,27.56 76.71,27.56 76.45,27.81 D9.C
N$21
  Top 0.254: R16.2 60.57,26.7 60.57,27.32 60.33,27.56 56.39,27.56 56.13,27.81 D8.C
N$22
  Top 0.254: D7.C 35.81,27.81 36.07,27.56 40.01,27.56 40.22,27.34 R15.2
NC1
  Top 1.778: K1.2 15.33,15.24 J5.3
  Bottom 1.778: K1.2 15.32,15.24 21.67,8.89 J5.3
NC2
  Top 1.778: K2.2 31.75,15.24 38.07,8.92 J6.3
  Bottom 1.778: K2.2 31.72,15.24 J6.3
NC3
  Top 1.778: J7.3 54.45,9.56 K3.2
  Bottom 1.778: 54.48,8.89 54.48,9.53 K3.2
NC4
  Top 1.778: J8.3 70.87,8.92 70.87,14.22 69.85,15.24 K4.2
  Bottom 1.778: J8.3 70.83,13.97 70.83,14.26 69.85,15.24 K4.2
NO1
  Top 1.778: K1.3 3.81,11.43 6.35,8.89 J5.1
  Bottom 1.778: J5.1 6.35,8.89 3.81,11.43 K1.3
NO2
  Top 1.778: J6.1 26.8,8.89 24.13,11.56 K2.3
  Bottom 1.778: J6.1 26.8,8.89 24.13,11.56 K2.3
NO3
  Top 1.778: J7.1 K3.3
  Bottom 1.778: J7.1 K3.3
NO4
  Top 1.778: J8.1 60.83,11.3 K4.3
  Bottom 1.778: J8.1 60.83,11.3 K4.3
OPTO_1  (via drill 0.35)
  Top 0.254: Q4.1 9.84,30.16 v10.54,30.86 | U3.5 17.14,34.16 v17.27,34.04
  Bottom 0.254: v10.54,30.86 10.92,31.24 18.54,31.24 19.05,31.75 19.05,33.02 18.03,34.04 v17.27,34.04
OPTO_2  (via drill 0.35)
  Top 0.254: v19.68,34.04 U3.7 | v28.19,30.86 28.57,30.86 28.89,30.55 Q3.1
  Bottom 0.254: v19.68,34.04 19.68,31.62 20.07,31.24 27.81,31.24 v28.19,30.86
OPTO_3  (via drill 0.35)
  Top 0.254: U2.5 43.81,34.67 44.32,34.16 45.85,34.16 v46.1,33.91 | Q2.1 49.21,30.16 v49.02,30.35
  Bottom 0.305: v46.1,33.91 47.12,32.89 47.12,31.88 48.64,30.35 v49.02,30.35
OPTO_4  (via drill 0.35)
  Top 0.254: Q1.1 69.53,30.67 v69.34,30.86 | U2.7 46.48,35.3 46.48,34.92 v47.5,33.91
  Bottom 0.254: v69.34,30.86 68.58,31.62 48.39,31.62 47.75,32.26 47.75,33.66 v47.5,33.91
RELAY_CTRL1
  Top 0.254: U5.10 32.38,42.29 33.4,43.31 35.56,43.31 36.07,42.8 38.23,42.8 39.62,41.4 R2.2
RELAY_CTRL2
  Top 0.254: U5.11 | U5.11 31.11,41.91 32.51,43.31 33.02,43.81 35.81,43.81 36.32,43.31 38.86,43.31 41.66,40.51 R3.2
RELAY_CTRL3
  Top 0.254: R10.2 23.11,40.77 25.27,42.93 28.96,42.93 29.84,42.04 U5.12
RELAY_CTRL4
  Top 0.254: U5.13 28.57,41.78 27.94,42.42 25.91,42.42 25.02,41.53 R11.2
SCL/SCK  (via drill 0.35)
  Top 0.254: J2.4 75.16,37.19 v74.8,36.83 | J4.3 32.26,39.24 33.66,40.64 U5.9 v33.66,42.16 | 48.39,33.15 48.26,33.15 | 48.26,33.15 44.2,33.15 v43.94,33.15 | v20.57,33.15 v16.51,33.15 | J3.4 7.21,34.19 8.26,33.15 v9.4,33.15 | 48.26,33.15 48.39,33.15 | 48.39,33.15 v48.77,33.53
  Bottom 0.254: v16.51,33.15 v9.4,33.15 | J1.1 35.56,44.58 33.66,42.67 v33.66,42.16 | J4.3 30.86,39.24 30.23,38.61 30.23,35.56 30.86,34.92 42.55,34.92 43.94,33.53 v43.94,33.15 43.94,32.89 43.69,32.64 21.34,32.64 20.83,33.15 v20.57,33.15 | v74.8,36.83 74.3,36.32 74.3,34.16 73.66,33.53 v48.77,33.53 | v20.57,33.15
SDA/MOSI  (via drill 0.35)
  Top 0.254: v20.57,32.13 v18.16,32.13 | J1.2 33.02,44.58 33.27,44.32 36.7,44.32 v36.83,44.2 | J4.4 32.51,38.1 34.92,38.1 | 34.92,38.1 v35.94,38.1 | U5.7 34.92,38.1 | J3.3 7.49,35.19 v7.75,34.92 | v75.18,35.69 75.68,36.19 J2.3 | v49.28,32.51 48.9,32.13 v46.1,32.13
  Bottom 0.254: v18.16,32.13 8.26,32.13 7.75,32.64 v7.75,34.92 | v35.94,38.1 35.94,36.2 36.7,35.43 43.31,35.43 46.1,32.64 v46.1,32.13 43.05,32.13 v20.57,32.13 | v35.94,38.1 | v35.94,38.1 35.94,42.8 36.83,43.69 v36.83,44.2 | v75.18,35.69 75.18,33.4 74.3,32.51 v49.28,32.51
VIN
  Top 0.508: D11.A 66.91,32.64 J9.PWR
  Bottom 0.508: J9.PWR 60.84,36.34 JP7.1

### Text on the board
Bottom: x02
Milling: Route Out | Route Out | Route Out | Route Out | Route Out | Route Out | Route Out | Route Out
tDocu: Elias Santistevan